# Altium project ESP_Grow_Main_V2.PrjPCB (part 1 of 2)
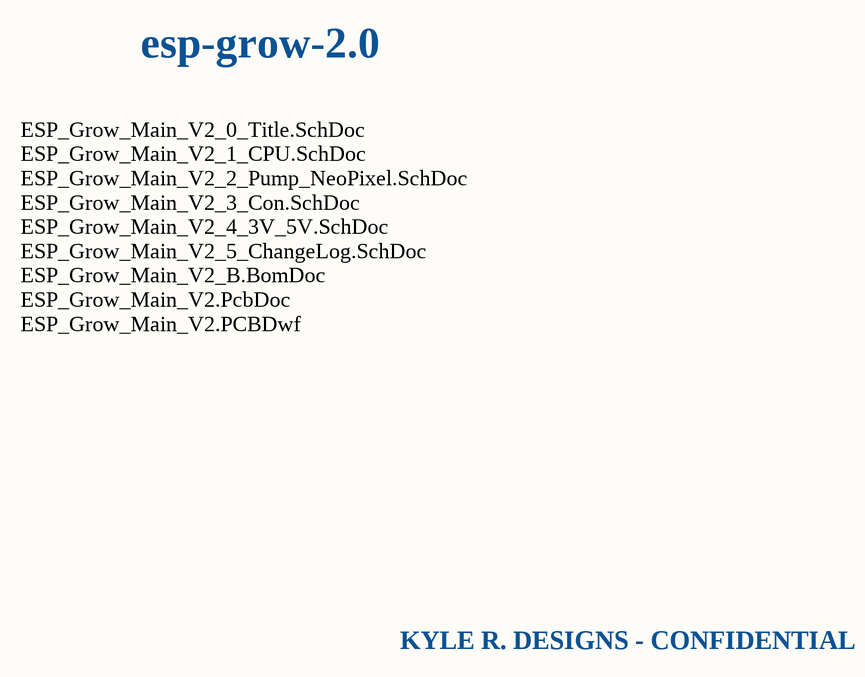
[diagram p0: ESP_Grow_Main_V2_0_Title.SchDoc]
5 sheets, 127 parts. Net scope: global (net labels, ports and power ports of the same name join across sheets).
Board file: ESP_Grow_Main_V2.PcbDoc
Sheets:
  ESP_Grow_Main_V2_0_Title.SchDoc
  ESP_Grow_Main_V2_1_CPU.SchDoc
  ESP_Grow_Main_V2_2_Pump_NeoPixel.SchDoc
  ESP_Grow_Main_V2_3_Con.SchDoc
  ESP_Grow_Main_V2_4_3V_5V.SchDoc

## Sheet ESP_Grow_Main_V2_0_Title.SchDoc: Title Page
size A; Author: Kyle R; DocumentNumber: 3282021; Revision: A; SheetNumber: 0; SheetTotal: 5

### Notes on the sheet
- esp-grow-2.0
- ESP_Grow_Main_V2_0_Title.SchDoc
  ESP_Grow_Main_V2_1_CPU.SchDoc
  ESP_Grow_Main_V2_2_Pump_NeoPixel.SchDoc
  ESP_Grow_Main_V2_3_Con.SchDoc
  ESP_Grow_Main_V2_4_3V_5V.SchDoc
  ESP_Grow_Main_V2_5_ChangeLog.SchDoc
  ESP_Grow_Main_V2_B.BomDoc
  ESP_Grow_Main_V2.PcbDoc
  ESP_Grow_Main_V2.PCBDwf
- KYLE R. DESIGNS - CONFIDENTIAL

## Sheet ESP_Grow_Main_V2_1_CPU.SchDoc: CPU
size A; DocumentNumber: 3/7/2021; Revision: A; SheetNumber: 5; SheetTotal: 1
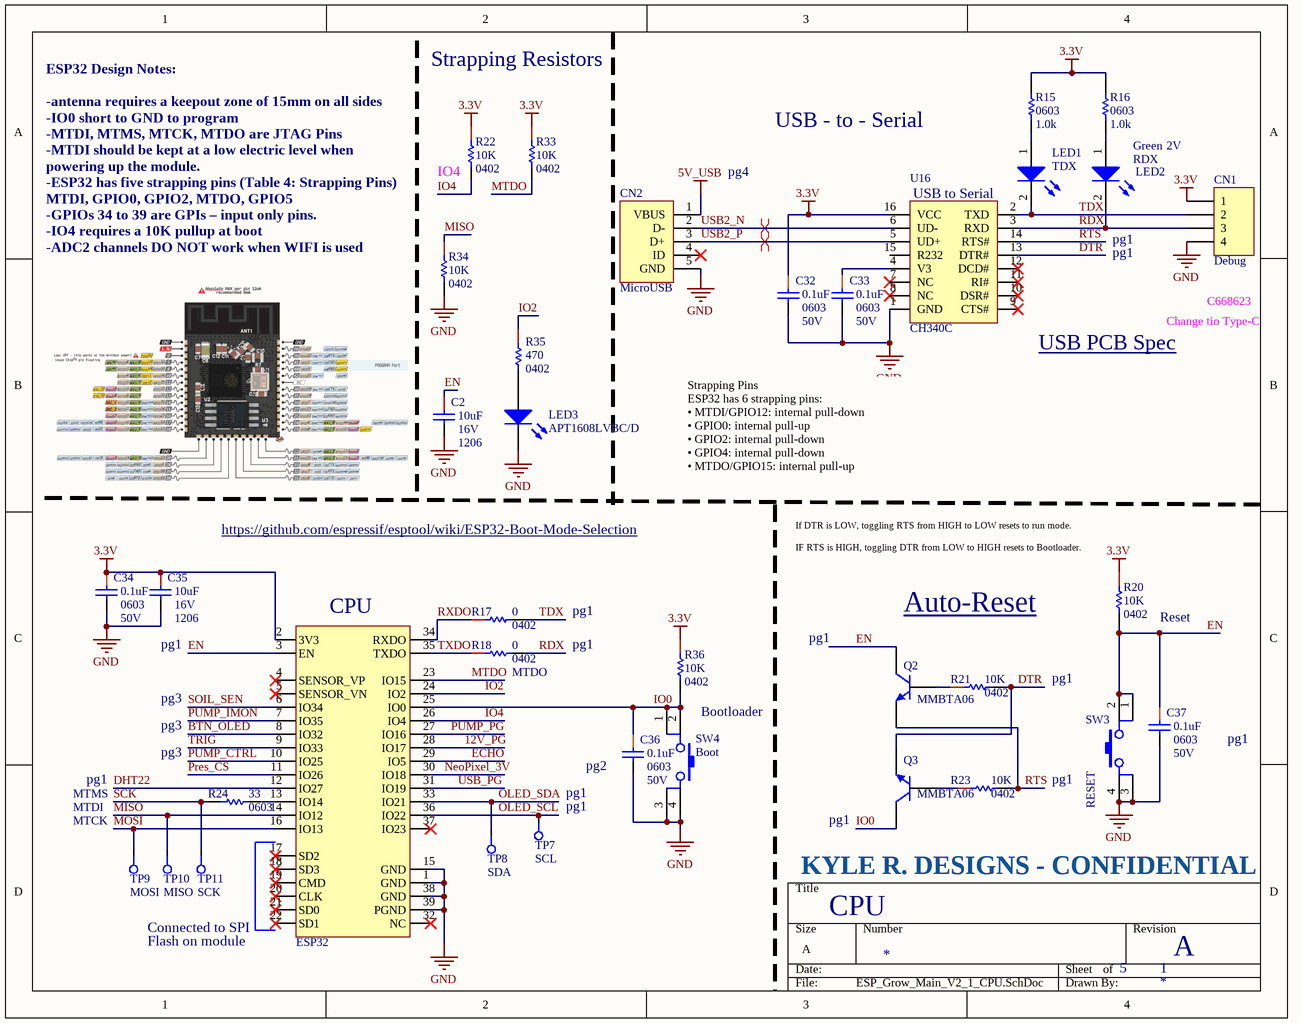
[diagram p1: ESP_Grow_Main_V2_1_CPU.SchDoc]

### Parts
C2  10uF  Voltage - Rated: 16V  Package: 1206  [CAPC1206(3216)_M]
C32  Package / Case: 0603  Voltage - Rated: 50V  [CAPC0603(1608)_L]  (hidden comment: 0.1uF)
C33  Package / Case: 0603  Voltage - Rated: 50V  [CAPC0603(1608)_L]  (hidden comment: 0.1uF)
C34  Package / Case: 0603  Voltage - Rated: 50V  [CAPC0603(1608)_L]  (hidden comment: 0.1uF)
C35  10uF  Voltage - Rated: 16V  Package: 1206  [CAPC1206(3216)_M]
C36  Package / Case: 0603  Voltage - Rated: 50V  [CAPC0603(1608)_L]  (hidden comment: 0.1uF)
C37  Package / Case: 0603  Voltage - Rated: 50V  [CAPC0603(1608)_L]  (hidden comment: 0.1uF)
CN1  Debug  [HDR1X4]
CN2  MicroUSB  [10118194-0001LF]
LED1  TDX  [SM-LED-0603]
LED2  RDX  Color: Green  Voltage - Forward (Vf) (Typ): 2V  [SM-LED-0603]
LED3  APT1608LVBC/D  [SM-LED-0603]
Q2  MMBTA06  [SOT23]
Q3  MMBTA06  [SOT23]
R15  Package / Case: 0603  [RESC0603(1608)_N]  (hidden comment: 1.0K)
R16  Package / Case: 0603  [RESC0603(1608)_N]  (hidden comment: 1.0K)
R17  Package (Imperial): 0402  Resistance: 0  [RESC0402(1005)_M]  (hidden comment: 0.0)
R18  Package (Imperial): 0402  Resistance: 0  [RESC0402(1005)_M]  (hidden comment: 0.0)
R20  Resistance: 10K  Package: 0402  [RESC0402(1005)_N]  (hidden comment: 0402WGF1002TCE)
R21  Resistance: 10K  Package: 0402  [RESC0402(1005)_N]  (hidden comment: 0402WGF1002TCE)
R22  Resistance: 10K  Package: 0402  [RESC0402(1005)_N]  (hidden comment: 0402WGF1002TCE)
R23  Resistance: 10K  Package: 0402  [RESC0402(1005)_N]  (hidden comment: 0402WGF1002TCE)
R24  Package / Case: 0603  [RESC0603(1608)_L]  (hidden comment: 33)
R33  Resistance: 10K  Package: 0402  [RESC0402(1005)_N]  (hidden comment: 0402WGF1002TCE)
R34  Resistance: 10K  Package: 0402  [RESC0402(1005)_N]  (hidden comment: 0402WGF1002TCE)
R35  Package (Imperial): 0402  [RESC0402(1005)_M]  (hidden comment: 470)
R36  Resistance: 10K  Package: 0402  [RESC0402(1005)_N]  (hidden comment: 0402WGF1002TCE)
SW3  RESET  [SW TACT Red 6mm x 6mm]
SW4  Boot  [SW TACT Red 6mm x 6mm]
TP7  SCL  [Pogo-Testpoint]  (no BOM)
TP8  SDA  [Pogo-Testpoint]  (no BOM)
TP9  MOSI  [Pogo-Testpoint]  (no BOM)
TP10  MISO  [Pogo-Testpoint]  (no BOM)
TP11  SCK  [Pogo-Testpoint]  (no BOM)
U16  CH340C  [SOP-16]
U17  ESP32  [ESP32]

### Nets
3.3V: C32.1 C34.1 C35.1 CN1.1 R15.2 R16.2 R20.1 R22.1 R33.1 R36.1 U16.16(VCC) U17.2(3V3)
5V_USB: CN2.1(VBUS)
GND: C2.2 C32.2 C33.2 C34.2 C35.2 C36.2 C37.2 CN1.4 CN2.5(GND) LED3.2(Cathode) R34.2 SW3.3 SW3.4 SW4.3 SW4.4 U16.1(GND) U17.1(GND) U17.15(GND) U17.38(GND) U17.39(PGND)
12V_PG: U17.28(IO17)
BTN_OLED: U17.8(IO32)
DHT22: U17.12(IO27)
DTR: Q3.2(E) R21.2 U16.13(DTR#)
ECHO: U17.29(IO5)
EN: C2.1 C37.1 Q2.3(C) R20.2 SW3.1 SW3.2 U17.3(EN)
IO0: C36.1 Q3.3(C) R36.2 SW4.1 SW4.2 U17.25(IO0)
IO2: R35.1 U17.24(IO2)
IO4: R22.2 U17.26(IO4)
MISO: R34.1 TP10.1 U17.14(IO12)
MOSI: TP9.1 U17.16(IO13)
MTDO: R33.2 U17.23(IO15)
NeoPixel_3V: U17.30(IO18)
OLED_SCL: TP7.1 U17.36(IO22)
OLED_SDA: TP8.1 U17.33(IO21)
Pres_CS: U17.11(IO26)
PUMP_CTRL: U17.10(IO25)
PUMP_IMON: U17.7(IO35)
PUMP_PG: U17.27(IO16)
RDX: CN1.3 LED2.2(K) R18.2 U16.3(RXD)
RTS: Q2.2(E) R23.2 U16.14(RTS#)
RXDO: R17.1 U17.34(RXDO)
SCK: R24.2 TP11.1
SOIL_SEN: U17.6(IO34)
TDX: CN1.2 LED1.2(K) R17.2 U16.2(TXD)
TRIG: U17.9(IO33)
TXDO: R18.1 U17.35(TXDO)
USB2_N: CN2.2(D-) U16.6(UD-)
USB2_P: CN2.3(D+) U16.5(UD+)
USB_PG: U17.31(IO19)
NetC33_1: C33.1 U16.4(V3)
NetLED1_1: LED1.1(A) R15.1
NetLED2_1: LED2.1(A) R16.1
NetLED3_1: LED3.1(Anode) R35.2
NetQ2_1: Q2.1(B) R21.1
NetQ3_1: Q3.1(B) R23.1
NetR24_1: R24.1 U17.13(IO14)

Not connected (* = marked no-connect by the designer): CN2 4(ID)*; U16 7(NC)* 8(NC)* 9(CTS#)* 10(DSR#)* 11(RI#)* 12(DCD#)* 15(R232); U17 4(SENSOR_VP)* 5(SENSOR_VN)* 17(SD2)* 18(SD3)* 19(CMD)* 20(CLK)* 21(SD0)* 22(SD1)* 32(NC)* 37(IO23)*

### Layout directives
differential pair: USB2_N, USB2_P

### Notes on the sheet
- Strapping Resistors
- USB - to - Serial
- (near R22) IO4
- pg4
- pg1
- (near U16) USB PCB Spec <https://www.ftdichip.com/Support/Documents/AppNotes/AN_146_USB_Hardware_Design_Guidelines_for_FTDI_ICs.pdf>
- Change tio Type-C
- C668623
- ESP32 Design Notes:
  -antenna requires a keepout zone of 15mm on all sides
  -IO0 short to GND to program
  -MTDI, MTMS, MTCK, MTDO are JTAG Pins
  -MTDI should be kept at a low electric level when powering up the module.
  -ESP32 has five strapping pins (Table 4: Strapping Pins) MTDI, GPIO0, GPIO2, MTDO, GPIO5
  -GPIOs 34 to 39 are GPIs – input only pins.
  -IO4 requires a 10K pullup at boot
  -ADC2 channels DO NOT work when WIFI is used
- Strapping Pins
  ESP32 has 6 strapping pins:
  • MTDI/GPIO12: internal pull-down
  • GPIO0: internal pull-up
  • GPIO2: internal pull-down
  • GPIO4: internal pull-down
  • MTDO/GPIO15: internal pull-up
  • GPIO5: internal pull-up
- https://github.com/espressif/esptool/wiki/ESP32-Boot-Mode-Selection
- (near R20) If DTR is LOW, toggling RTS from HIGH to LOW resets to run mode.
  IF RTS is HIGH, toggling DTR from LOW to HIGH resets to Bootloader.
- (near U17) CPU
- Auto-Reset <https://cdn.sparkfun.com/assets/learn_tutorials/5/0/7/esp32-thing-schematic.pdf>
- (near R20) Reset
- (near C35) pg1
- pg3
- (near R18) MTDO
- (near C36) pg2
- Bootloader
- MTMS
- MTDI
- (near TP9) MTCK
- (near TP7) pg1
- (near Q3) pg1
- KYLE R. DESIGNS - CONFIDENTIAL
- (near U17) Flash on module
- (near U17) Connected to SPI
- (in symbol CH340C) USB to Serial

### Library data of the parts
C2 C35 = CAP CER 10UF 16V 1206: Temperature Coefficient: X7R; LCSC: C126600; Capacitance: 10uF; Supplier 1: Digi-Key; Supplier Part Number 1: 490-4793-1-ND
C32-C34 C36 C37 = 0.1uF_0603: 100NF 50V 0603; Manufacturer: YAGEO; Manufacturer Part Number: CC0603KRX7R9BB104; Tolerance: ±10%; Temperature Coefficient: X7R; Supplier 1: Digi-Key; RoHS: RoHS Compliant; Category: Capacitors; Stock 1: 2360000; Pricing 1: 4000=0.00414, 8000=0.00378, 12000=0.0036, 28000=0.00342, 100000=0.00248 (USD); Packaging: Tape & Reel (TR); Mounting Type: Surface Mount, MLCC; Operating Temperature: -55°C ~ 125°C; Applications: General Purpose; Ratings: -; Size / Dimension: 0.063" L x 0.031" W (1.60mm x 0.80mm); Height - Seated (Max): -; Thickness (Max): 0.034" (0.87mm); Lead Spacing: -; Features: -; Lead Style: -; ComponentLink1URL: http://www.kemet.com/datasheets&C0603C104K4RACTU; ComponentLink1Description: http://www.kemet.com/datasheets&C0603C104K4RACTU; Supplier Part Number 1: 399-1096-2-ND; ComponentLink2Description: New link; ComponentLink2URL: *; LCSC Part #: C14663; Capacitance: 0.1uF
CN1 = Header 4: Header, 4-Pin; Manufacturer: Sullins Connector Solutions; Manufacturer Part Number: PRPC004SAAN-RC; Connector Type: Header, Unshrouded, Breakaway; Number of Positions: 4; Number of Positions Loaded: All; Pitch: 0.100" (2.54mm); Supplier 1: Digi-Key; RoHS: RoHS Compliant; Category: Connectors, Interconnects; Stock 1: 0; Pricing 1: 1=0.2, 10=0.175, 100=0.1443, 500=0.1141, 1000=0.09794, 5000=0.08935, 10000=0.08591 (USD); Packaging: Bulk; Contact Type: Male Pin; Number of Rows: 1; Row Spacing: -; Contact Mating Length: 0.230" (5.84mm); Mounting Type: Through Hole; Termination: Solder; Fastening Type: -; Features: -; Contact Finish: Gold; Contact Finish Thickness: Flash; Color: Black; ComponentLink1URL: http://media.digikey.com/PDF/Data%20Sheets/Sullins%20PDFs/xRxCzzzSxxN-RC_ST_11635-B.pdf; ComponentLink1Description: http://media.digikey.com/PDF/Data%20Sheets/Sullins%20PDFs/xRxCzzzSxxN-RC_ST_11635-B.pdf; Supplier Part Number 1: S1011EC-04-ND
CN2 = 10118194-0001LF: Amphenol FCI CONN USB MICRO B RECPT SMT R/A; Connector Type: USB - micro B; Number of Contacts: 5; Gender: Receptacle; Specifications: USB 2.0; Number of Ports: 1; Current Rating: 1.8A per Contact; Voltage - Rated: 100VAC; Mating Cycles: 10000; Shielding: Shielded; Material Flammability Rating: UL94 V-0; ClassName: *; Supplier 1: Digi-Key; Manufacturer: Amphenol FCI; Manufacturer Part Number: 10118194-0001LF; RoHS: RoHS Compliant; Category: Connectors, Interconnects; Stock 1: 220681; Pricing 1: 1=0.46, 10=0.437, 25=0.3744, 50=0.318, 100=0.3056, 250=0.27444, 500=0.26196 (USD); Packaging: Cut Tape (CT); Part Status: Active; Mounting Type: Surface Mount, Right Angle; Through Hole; Mounting Feature: Horizontal; Termination: Solder; Features: Solder Retention; Ingress Protection: -; Operating Temperature: -30°C ~ 80°C; Contact Finish: Gold; Shell/Shielding Material: Steel, Stainless; Insulation Color: Black; ComponentLink1URL: http://portal.fciconnect.com/Comergent//fci/drawing/10118194.pdf; ComponentLink1Description: http://portal.fciconnect.com/Comergent//fci/drawing/10118194.pdf; Supplier Part Number 1: 609-4618-1-ND
LED1 = CMP-001-0086-06: LED GREEN CLEAR THIN 0603 SMD; Manufacturer Part Number: LTST-C191KGKT; Manufacturer: Lite-On Inc; Millicandela Rating: 35mcd; Wavelength - Peak: 574nm; Current - Test: 20mA; Wavelength - Dominant: 571nm; Viewing Angle: 130°; Lens Style/Size: Rectangle with Flat Top, 1.1mm x 0.8mm; Voltage - Forward (Vf) (Typ): 2V; Color: Green; Size / Dimension: 1.60mm L x 0.80mm W; Mounting Type: Surface Mount; Designator: LTST-C191KGKT; Height: 0.55mm; RoHS: RoHS Compliant; Package / Case: 0603 (1608 Metric); Packaging: Cut Tape (CT); Lens Type: Clear; Pin Count: 2; Stock 1: 84829; Pricing 1: 1=0.3, 10=0.238, 100=0.1296, 250=0.0864, 500=0.07344, 1000=0.05616, 2500=0.05076 (USD); ClassName: *
LED2 = CMP-001-0086-06: LED GREEN CLEAR THIN 0603 SMD; Manufacturer Part Number: LTST-C191KGKT; Manufacturer: Lite-On Inc; Millicandela Rating: 35mcd; Wavelength - Peak: 574nm; Current - Test: 20mA; Wavelength - Dominant: 571nm; Viewing Angle: 130°; Lens Style/Size: Rectangle with Flat Top, 1.1mm x 0.8mm; Size / Dimension: 1.60mm L x 0.80mm W; Mounting Type: Surface Mount; Designator: LTST-C191KGKT; Height: 0.55mm; RoHS: RoHS Compliant; Package / Case: 0603 (1608 Metric); Packaging: Cut Tape (CT); Lens Type: Clear; Pin Count: 2; Stock 1: 84829; Pricing 1: 1=0.3, 10=0.238, 100=0.1296, 250=0.0864, 500=0.07344, 1000=0.05616, 2500=0.05076 (USD); ClassName: *
LED3 = CMP-001-0901-02: LED BLUE CLEAR 2SMD 2.65V; Luminous Intensity: 24mcd; Test Current: 2mA; Dominant Wavelength: 470nm; Viewing Angle: 120°; Lens Color: Colorless; Case Code (Metric): 1608; Length: 1.6mm; Forward Voltage: 2.65V; Width: 0.8mm; Height: 0.75mm; Packaging: Tape and Reel; Case/Package: 0603; Mount: Surface Mount; Color: Blue; Lens Transparency: Clear; Case Code (Imperial): 0603
Q2 Q3 = MMBTA06: TRANS NPN 80V 0.5A SOT-23; Manufacturer: ON Semiconductor; Manufacturer Part Number: MMBTA06LT3G; Vce Saturation (Max) @ Ib, Ic: 250mV @ 10mA, 100mA; Current - Collector Cutoff (Max): 100nA; DC Current Gain (hFE) (Min) @ Ic, Vce: 100 @ 100mA, 1V; Frequency - Transition: 100MHz; Supplier 1: Digi-Key; RoHS: RoHS Compliant; Category: Discrete Semiconductor Products; Stock 1: 16604; Pricing 1: 1=0.21, 10=0.196, 100=0.1067, 500=0.06566, 1000=0.04476 (USD); Packaging: Cut Tape (CT); Part Status: Active; Transistor Type: NPN; Operating Temperature: -55°C ~ 150°C (TJ); Mounting Type: Surface Mount; Package / Case: TO-236-3, SC-59, SOT-23-3; Supplier Device Package: SOT-23-3 (TO-236); Base Part Number: MMBTA06; ComponentLink1URL: http://www.onsemi.com/pub/Collateral/MMBTA05LT1-D.PDF; ComponentLink1Description: http://www.onsemi.com/pub/Collateral/MMBTA05LT1-D.PDF; Supplier Part Number 1: MMBTA06LT3GOSCT-ND
R15 R16 = RES 1K OHM 1% 1/10W 0603: 1.0K 0603; Manufacturer: Stackpole Electronics Inc.; Manufacturer Part Number: RMCF0603FT1K00; Tolerance: ±1%; Power (Watts): 0.1W, 1/10W; Temperature Coefficient: ±100ppm/°C; Supplier 1: Digi-Key; RoHS: RoHS Compliant; Category: Resistors; Stock 1: 411308; Pricing 1: 1=0.1, 10=0.02, 100=0.0081, 1000=0.00364, 2500=0.00316 (USD); Packaging: Cut Tape (CT); Part Status: Active; Composition: Thick Film; Features: Automotive AEC-Q200; Operating Temperature: -55°C ~ 155°C; Size / Dimension: 0.061" L x 0.031" W (1.55mm x 0.80mm); Height - Seated (Max): 0.022" (0.55mm); Failure Rate: -; ComponentLink1URL: https://www.seielect.com/Catalog/SEI-RMCF_RMCP.pdf; ComponentLink1Description: https://www.seielect.com/Catalog/SEI-RMCF_RMCP.pdf; Supplier Part Number 1: RMCF0603FT1K00CT-ND; Supplier Device Package: 0603; Resistance (Ohms): 1.0k
R17 R18 = CMP-007-0303-14: RES 0.0 OHM JUMPER 1/10W 0402; Power: 63mW; Package (Metric): 1005; Tolerance: 0%; Operating Temperature: -55°C ~ 155°C; Length: 1mm; Temperature Coefficient: -; Height: 400µm; Termination: SMD/SMT
R20-R23 R33 R34 R36 = 10k_0402: 10KOHMS ±1% 1/10W 0402; Supplier Part Number 1: C25744; Manufacturer Part Number 1: 0402WGF1002TCE; Supplier 1: LCSC
R24 = RES 33 OHM 1/10W 5% 0603 SMD: 33 0603; Manufacturer: Panasonic Electronic Components; Manufacturer Part Number: ERJ-3GEYJ330V; Tolerance: ±5%; Power (Watts): 0.1W, 1/10W; Temperature Coefficient: ±200ppm/°C; Supplier 1: Digi-Key; RoHS: RoHS Compliant; Category: Resistors; Stock 1: 499360; Pricing 1: 1=0.1, 50=0.0126, 100=0.0096, 250=0.00716, 500=0.00528, 1000=0.00352, 2500=0.00297 (USD); Packaging: Cut Tape (CT); Resistance (Ohms): 33; Composition: Thick Film; Features: -; Supplier Device Package: 0603; Size / Dimension: 0.063" L x 0.031" W (1.60mm x 0.80mm); Height: 0.022" (0.55mm); Number of Terminations: 2; ComponentLink1URL: http://industrial.panasonic.com/www-cgi/jvcr13pz.cgi?E+PZ+3+AOA0001+ERJ3GEYJ330V+7+WW; ComponentLink1Description: http://industrial.panasonic.com/www-cgi/jvcr13pz.cgi?E+PZ+3+AOA0001+ERJ3GEYJ330V+7+WW; Supplier Part Number 1: P33GCT-ND
R35 = CMP-007-0512-12: RES 470 OHM 1% 1/10W 0402; Temperature Coefficient: ±100ppm/°C; Power: 63mW; Package (Metric): 1005; Operating Temperature: -55°C ~ 155°C; Height: 400µm; Length: 1mm; Termination: SMD/SMT; Tolerance: 1%; Resistance: 470
SW3 SW4 = PTS645SM43SMTR92 LFS: SWITCH TACTILE SPST-NO 0.05A 12V; Manufacturer: C&K; Switch Function: Off-Mom; Contact Rating @ Voltage: 0.05A @ 12VDC; Actuator Type: Standard; Actuator Height off PCB, Vertical: 4.30mm; Actuator Orientation: Top Actuated; Outline: 6.00mm x 6.00mm; Illumination: Non-Illuminated; Operating Force: 160gf; Actuator Material: Polyamide (PA66), Nylon 6/6; Mechanical Life: 100,000 Cycles; ClassName: *; Supplier 1: Digi-Key; Manufacturer Part Number: PTS645SM43SMTR92 LFS; RoHS: RoHS Compliant; Category: Switches; Stock 1: 234699; Pricing 1: 1=0.15, 10=0.147, 25=0.1416, 50=0.1366, 100=0.129, 250=0.12144, 500=0.11638 (USD); Packaging: Cut Tape (CT); Part Status: Active; Circuit: SPST-NO; Mounting Type: Surface Mount; Actuator Length, Right Angle: -; Termination Style: Gull Wing; Illumination Type, Color: -; Illumination Voltage (Nominal): -; Ingress Protection: -; Features: Blue Actuator; Switch Travel: -; Operating Temperature: -20°C ~ 60°C; ComponentLink1URL: http://www.ckswitches.com/media/1471/pts645.pdf; ComponentLink1Description: http://www.ckswitches.com/media/1471/pts645.pdf; Supplier Part Number 1: CKN9112CT-ND
TP7-TP11 = CMP-001-0557-03: Test Point- Current one; Pin Count: 1; Component Name: TestPoint; Designator: TestPoint
U16 = CH340C: USB to Serial UART; ComponentLink2URL: https://lcsc.com/product-detail/USB_CH340C_C84681.html; ComponentLink1URL: https://www.sparkfun.com/products/15096; ComponentLink2Description: LCSC Part Link; ComponentLink1Description: Sparkfun Demo Board
U17 = U/ESP32-WROOM-32D: ESP32 module

## Sheet ESP_Grow_Main_V2_2_Pump_NeoPixel.SchDoc: Pump_Neopixel
size A; Date: 06/02/2019; Author: Kyle R.; Revision: A; SheetNumber: 2; SheetTotal: 5
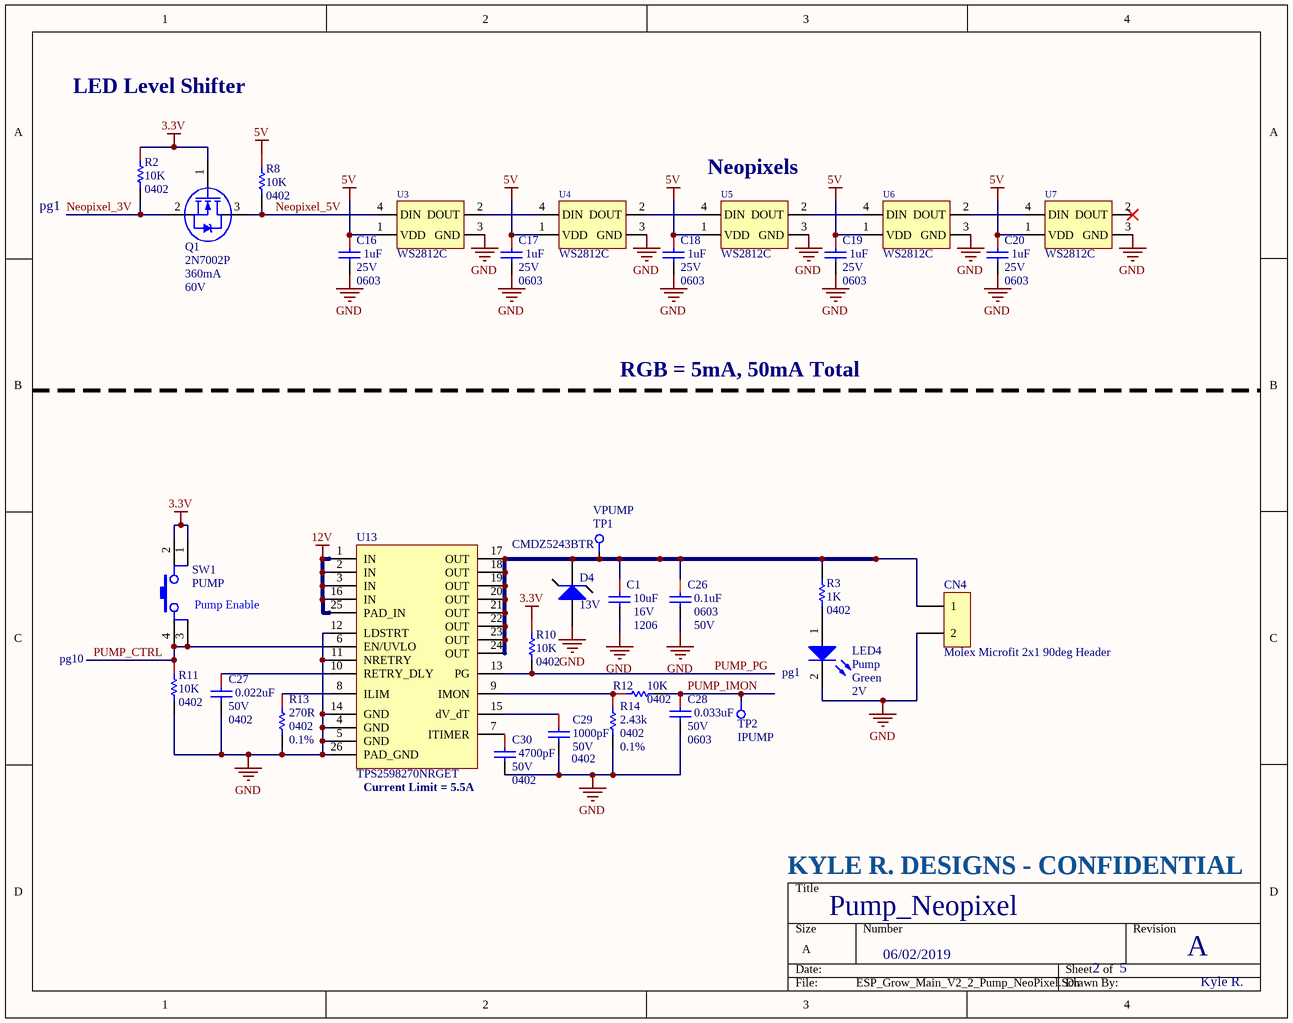
[diagram p2: ESP_Grow_Main_V2_2_Pump_NeoPixel.SchDoc]

### Parts
C1  10uF  Voltage - Rated: 16V  Package: 1206  [CAPC1206(3216)_M]
C16  1uF  Voltage - Rated: 25V  Package / Case: 0603  [CAPC0603(1608)_N]
C17  1uF  Voltage - Rated: 25V  Package / Case: 0603  [CAPC0603(1608)_N]
C18  1uF  Voltage - Rated: 25V  Package / Case: 0603  [CAPC0603(1608)_N]
C19  1uF  Voltage - Rated: 25V  Package / Case: 0603  [CAPC0603(1608)_N]
C20  1uF  Voltage - Rated: 25V  Package / Case: 0603  [CAPC0603(1608)_N]
C26  Package / Case: 0603  Voltage - Rated: 50V  [CAPC0603(1608)_L]  (hidden comment: 0.1uF)
C27  0.022uF  Voltage (Rated): 50V  Package (Imperial): 0402  [CAPC0402(1005)_N]
C28  0.033uF  Voltage (Rated): 50V  Package (Imperial): 0603  [CAPC0603(1608)_L]
C29  Voltage - Rated: 50V  Package / Case: 0402  [CAPC0402(1005)_N]  (hidden comment: 1000pF)
C30  4700pF  Voltage (Rated): 50V  Package (Imperial): 0402  [CAPC0402(1005)_L]
CN4  Molex Microfit 2x1 90deg Header  [Molex 2x1 Microfit 90deg]
D4  CMDZ5243BTR  Zener Voltage: 13V  [SOD-323]
LED4  Pump  Color: Green  Voltage - Forward (Vf) (Typ): 2V  [SM-LED-0603]
Q1  2N7002P  Continuous Drain Current (ID): 360mA  Drain to Source Voltage (Vdss): 60V  [SOT23]
R2  Resistance: 10K  Package: 0402  [RESC0402(1005)_N]  (hidden comment: 0402WGF1002TCE)
R3  Package / Case: 0402  [RESC0402(1005)_L]  (hidden comment: 1K)
R8  Resistance: 10K  Package: 0402  [RESC0402(1005)_N]  (hidden comment: 0402WGF1002TCE)
R10  Resistance: 10K  Package: 0402  [RESC0402(1005)_N]  (hidden comment: 0402WGF1002TCE)
R11  Resistance: 10K  Package: 0402  [RESC0402(1005)_N]  (hidden comment: 0402WGF1002TCE)
R12  Resistance: 10K  Package: 0402  [RESC0402(1005)_N]  (hidden comment: 0402WGF1002TCE)
R13  Tolerance: 0.1%  Resistance: 270R  Case Code (Imperial): 0402  [RESC0402(1005)_N]  (hidden comment: 270)
R14  Tolerance: 0.1%  Case/Package: 0402  Resistance: 2.43k  [RESC0402(1005)_L]  (hidden comment: 2.34k)
SW1  PUMP  [SW TACT Red 6mm x 6mm]
TP1  VPUMP  [Pogo-Testpoint]  (no BOM)
TP2  IPUMP  [Pogo-Testpoint]  (no BOM)
U3  WS2812C  [WS2812C]
U4  WS2812C  [WS2812C]
U5  WS2812C  [WS2812C]
U6  WS2812C  [WS2812C]
U7  WS2812C  [WS2812C]
U13  TPS2598270NRGET  [VQFN_24]

### Nets
3.3V: Q1.1(G) R2.1 R10.1 SW1.1 SW1.2
5V: C16.1 C17.1 C18.1 C19.1 C20.1 R8.1 U3.1(VDD) U4.1(VDD) U5.1(VDD) U6.1(VDD) U7.1(VDD)
12V: U13.1(IN) U13.2(IN) U13.3(IN) U13.16(IN) U13.25(PAD_IN)
GND: C1.2 C16.2 C17.2 C18.2 C19.2 C20.2 C26.2 C27.2 C28.2 C29.2 C30.2 CN4.2 D4.2(A) LED4.2(K) R11.2 R13.2 R14.2 U3.3(GND) U4.3(GND) U5.3(GND) U6.3(GND) U7.3(GND) U13.4(GND) U13.5(GND) U13.11(NRETRY) U13.12(LDSTRT) U13.14(GND) U13.26(PAD_GND)
NeoPixel_3V: Q1.2(S) R2.2
Neopixel_5V: Q1.3(D) R8.2 U3.4(DIN)
PUMP_CTRL: R11.1 SW1.3 SW1.4 U13.6(EN/UVLO)
PUMP_IMON: C28.1 R12.2 TP2.1
PUMP_PG: R10.2 U13.13(PG)
NetC1_1: C1.1 C26.1 CN4.1 D4.1(K) R3.2 TP1.1 U13.17(OUT) U13.18(OUT) U13.19(OUT) U13.20(OUT) U13.21(OUT) U13.22(OUT) U13.23(OUT) U13.24(OUT)
NetC27_1: C27.1 U13.10(RETRY_DLY)
NetC29_1: C29.1 U13.15(dV_dT)
NetC30_1: C30.1 U13.7(ITIMER)
NetLED4_1: LED4.1(A) R3.1
NetR12_1: R12.1 R14.1 U13.9(IMON)
NetR13_1: R13.1 U13.8(ILIM)
NetU3_2: U3.2(DOUT) U4.4(DIN)
NetU4_2: U4.2(DOUT) U5.4(DIN)
NetU5_2: U5.2(DOUT) U6.4(DIN)
NetU6_2: U6.2(DOUT) U7.4(DIN)

Not connected (* = marked no-connect by the designer): U7 2(DOUT)*

### Notes on the sheet
- LED Level Shifter
- pg1
- (near U5) Neopixels
- RGB = 5mA, 50mA Total
- (near SW1) Pump Enable
- pg10
- (near LED4) pg1
- Current Limit = 5.5A
- KYLE R. DESIGNS - CONFIDENTIAL

### Library data of the parts
C1 = CAP CER 10UF 16V 1206: Temperature Coefficient: X7R; LCSC: C126600; Capacitance: 10uF; Supplier 1: Digi-Key; Supplier Part Number 1: 490-4793-1-ND
C16-C20 = CAP CER 1UF 25V 10% X7R 0603: 1uF 0603 25V; Manufacturer: TDK Corporation; Manufacturer Part Number: CGA3E1X7R1E105K080AC; Tolerance: ±10%; Temperature Coefficient: X7R; Supplier 1: Digi-Key; RoHS: RoHS Compliant; Category: Capacitors; Stock 1: 360610; Pricing 1: 1=0.2, 10=0.135, 100=0.0686, 500=0.04696, 1000=0.04154 (USD); Packaging: Cut Tape (CT); Part Status: Active; Operating Temperature: -55°C ~ 125°C; Features: -; Ratings: AEC-Q200; Applications: Automotive; Failure Rate: -; Mounting Type: Surface Mount, MLCC; Size / Dimension: 0.063" L x 0.032" W (1.60mm x 0.80mm); Height - Seated (Max): -; Thickness (Max): 0.035" (0.90mm); Lead Spacing: -; Lead Style: -; ComponentLink1URL: https://product.tdk.com/info/en/catalog/datasheets/mlcc_automotive_general_en.pdf; ComponentLink1Description: https://product.tdk.com/info/en/catalog/datasheets/mlcc_automotive_general_en.pdf; Supplier Part Number 1: 445-6931-1-ND
C26 = 0.1uF_0603: as C32 on sheet ESP_Grow_Main_V2_1_CPU; Supplier 1: Digi-Key; RoHS: RoHS Compliant; Category: Capacitors; Stock 1: 2360000; Pricing 1: 4000=0.00414, 8000=0.00378, 12000=0.0036, 28000=0.00342, 100000=0.00248 (USD); Packaging: Tape & Reel (TR); Mounting Type: Surface Mount, MLCC; Operating Temperature: -55°C ~ 125°C; Applications: General Purpose; Ratings: -; Size / Dimension: 0.063" L x 0.031" W (1.60mm x 0.80mm); Height - Seated (Max): -; Thickness (Max): 0.034" (0.87mm); Lead Spacing: -; Features: -; Lead Style: -; ComponentLink1URL: http://www.kemet.com/datasheets&C0603C104K4RACTU; ComponentLink1Description: http://www.kemet.com/datasheets&C0603C104K4RACTU; Supplier Part Number 1: 399-1096-2-ND; ComponentLink2Description: New link; ComponentLink2URL: *; LCSC Part #: C14663; Capacitance: 0.1uF
C27 = CMP-007-0030-08: CAP CER 0.022UF 50V X7R 0402; Tolerance: 10%; Package (Metric): 1005; Capacitance: 22nF; Dielectric Material: Ceramic; Temperature Coefficient: X7R; Mounting Type: SMD
C28 = CMP-007-0033-08: CAP CER 0.033UF 50V X7R 0603; Tolerance: 5%; Package (Metric): 1608; Dielectric Material: Ceramic; Capacitance: 33nF; Temperature Coefficient: X7R; Mounting Type: SMD
C29 = CAP CER 1000PF 50V C0G/NP0 0402: 1000pF 50V C0G 0402 Kemet 2017; Manufacturer Part Number: C0402C102J5GACTU; Tolerance: ±5%; Temperature Coefficient: C0G, NP0; Supplier 1: Digi-Key; Manufacturer: KEMET; RoHS: RoHS Compliant; Category: Capacitors; Stock 1: 1400284; Pricing 1: 1=0.1, 10=0.07, 100=0.031, 500=0.02214, 1000=0.01739, 2500=0.01581, 5000=0.01455 (USD); Packaging: Cut Tape (CT); Part Status: Active; Operating Temperature: -55°C ~ 125°C; Features: Low ESL; Ratings: -; Applications: General Purpose; Failure Rate: -; Mounting Type: Surface Mount, MLCC; Size / Dimension: 0.039" L x 0.020" W (1.00mm x 0.50mm); Height - Seated (Max): -; Thickness (Max): 0.022" (0.55mm); Lead Spacing: -; Lead Style: -; Supplier Part Number 1: 399-10034-1-ND; Capacitance: 1000pF
C30 = CMP-007-0152-08: CAP CER 4700PF 50V X7R 0402; Dielectric Material: Ceramic; Package (Metric): 1005; Tolerance: 10%; Capacitance: 4.7nF; Mounting Type: SMD; Temperature Coefficient: X7R
CN4 = MICROFIT 3.0 HDR 90deg 2x1CKT: Manufacturer: Molex Inc; Manufacturer Part Number: 0430450200; Connector Type: Header, Shrouded; Number of Positions: 2; Number of Positions Loaded: All; Pitch: 0.118" (3.00mm); ClassName: *; Supplier 1: Digi-Key; RoHS: RoHS Compliant; Category: Connectors, Interconnects; Stock 1: 5243; Pricing 1: 1=0.92, 10=0.809, 50=0.7298, 100=0.6981, 250=0.6346, 500=0.57114, 1000=0.50768, 2500=0.46008, 5000=0.44422 (USD); Packaging: Tray; Contact Type: Male Pin; Number of Rows: 2; Row Spacing: 0.118" (3.00mm); Contact Mating Length: -; Mounting Type: Through Hole, Right Angle; Termination: Solder; Fastening Type: Locking Ramp; Features: Board Lock; Contact Finish: Tin; Contact Finish Thickness: 100µin (2.54µm); Color: Black; ComponentLink1URL: http://www.molex.com/pdm_docs/sd/430450200_sd.pdf; ComponentLink1Description: http://www.molex.com/pdm_docs/sd/430450200_sd.pdf; Supplier Part Number 1: WM1813-ND
D4 = CMP-001-0939-01: DIODE ZENER 13V 250MW SOD323; Tolerance: 5%; Impedance: 13R; Max Operating Temperature: 150°C; Max Power Dissipation: 250mW; Packaging: Tape and Reel; Min Operating Temperature: -65°C; Mount: Surface Mount
LED4 = CMP-001-0086-06: as LED2 on sheet ESP_Grow_Main_V2_1_CPU; Size / Dimension: 1.60mm L x 0.80mm W; Mounting Type: Surface Mount; Designator: LTST-C191KGKT; Height: 0.55mm; RoHS: RoHS Compliant; Package / Case: 0603 (1608 Metric); Packaging: Cut Tape (CT); Lens Type: Clear; Pin Count: 2; Stock 1: 84829; Pricing 1: 1=0.3, 10=0.238, 100=0.1296, 250=0.0864, 500=0.07344, 1000=0.05616, 2500=0.05076 (USD); ClassName: *
Q1 = CMP-012-0002-05: MOSFET N-CH 60V 0.36A SOT-23; Drain to Source Resistance: 1.6R; Gate to Source Voltage (Vgs): 20V; Turn-Off Delay Time: 10ns; Input Capacitance: 50pF; Max Power Dissipation: 350mW; Rise Time: 4ns; Fall Time: 5ns; Number of Elements: 1; Power Dissipation: 420mW; Turn-On Delay Time: 3ns; Contact Plating: Tin; Case/Package: SOT; Number of Pins: 3; Rds On Max: 1.6R; Package Quantity: 10000; Lead Free: Lead Free; Packaging: Tape and Reel; Max Dual Supply Voltage: 60V; Min Operating Temperature: -55°C; Radiation Hardening: No; Drain to Source Breakdown Voltage: 60V; Max Operating Temperature: 150°C
R2 R8 R10-R12 = 10k_0402: 10KOHMS ±1% 1/10W 0402; Supplier Part Number 1: C25744; Manufacturer Part Number 1: 0402WGF1002TCE; Supplier 1: LCSC
R3 = RES 1K OHM 1% 1/16W 0402: 1K 0402; Manufacturer: Yageo; Manufacturer Part Number: RC0402FR-071KL; Tolerance: 1%; Temperature Coefficient: 100ppm/°C; Power Rating: 62.5mW; Voltage Rating: 50V; ComponentLink1URL: https://datasheet.ciiva.com/2453/pyu-r-int-thick-7-2453361.pdf; ComponentLink1Description: https://datasheet.ciiva.com/2453/pyu-r-int-thick-7-2453361.pdf; ComponentLink2URL: https://datasheet.ciiva.com/2453/pyu-r-int-thick-7-2453362.pdf; ComponentLink2Description: https://datasheet.ciiva.com/2453/pyu-r-int-thick-7-2453362.pdf; ComponentLink3URL: https://datasheet.ciiva.com/2453/pyu-r-int-thick-7-2453363.pdf; ComponentLink3Description: https://datasheet.ciiva.com/2453/pyu-r-int-thick-7-2453363.pdf; ComponentLink4URL: https://datasheet.ciiva.com/22747/1018594-22747509.pdf; ComponentLink4Description: https://datasheet.ciiva.com/22747/1018594-22747509.pdf; ComponentLink5URL: https://datasheet.ciiva.com/15189/getdatasheetpartid-323696-15189334.pdf; ComponentLink5Description: https://datasheet.ciiva.com/15189/getdatasheetpartid-323696-15189334.pdf; ComponentLink6URL: https://datasheet.ciiva.com/16740/pyu-rc0402-51-rohs-l-6-r-16740567.pdf; ComponentLink6Description: https://datasheet.ciiva.com/16740/pyu-rc0402-51-rohs-l-6-r-16740567.pdf; ComponentLink7URL: https://datasheet.ciiva.com/12667/pyu-rc0402-51-rohs-l-6-r-12667930.pdf; ComponentLink7Description: https://datasheet.ciiva.com/12667/pyu-rc0402-51-rohs-l-6-r-12667930.pdf; ComponentLink8URL: https://datasheet.ciiva.com/11819/0900766b80c66297-11819452.pdf; ComponentLink8Description: https://datasheet.ciiva.com/11819/0900766b80c66297-11819452.pdf; Supplier 1: Digi-Key; Supplier Part Number 1: 311-1.00KLRCT-ND; Stock 1: 21888659; Pricing 1: 1=0.1, 10=0.014, 100=0.0056, 1000=0.0025, 2500=0.0022, 5000=0.0018 (USD); Case/Package: 0402; Number of Pins: 2; Case Code (Imperial): 0402; Case Code (Metric): 1005; Min Operating Temperature: -55°C; Max Operating Temperature: 155°C; Packaging: Tape and Reel; Composition: Thick Film; Voltage Rating (DC): 50V; Termination: SMD/SMT; Military Standard: Not; Length: 1mm; Height: 0.32mm; Width: 0.5mm; Depth: 0.5mm; REACH SVHC: Unknown; Lead Free: Lead Free; ComponentLink9URL: https://datasheet.ciiva.com/11819/0900766b80c66297-11819477.pdf; ComponentLink9Description: https://datasheet.ciiva.com/11819/0900766b80c66297-11819477.pdf; ComponentLink10URL: https://datasheet.ciiva.com/12666/pyu-rc0402-51-rohs-l-6-r-12666741.pdf; ComponentLink10Description: https://datasheet.ciiva.com/12666/pyu-rc0402-51-rohs-l-6-r-12666741.pdf; ComponentLink11URL: https://datasheet.ciiva.com/17063/pyu-rc0402-51-rohs-l-6-r-17063193.pdf; ComponentLink11Description: https://datasheet.ciiva.com/17063/pyu-rc0402-51-rohs-l-6-r-17063193.pdf; ComponentLink12URL: https://datasheet.ciiva.com/22747/1018594-22747513.pdf; ComponentLink12Description: https://datasheet.ciiva.com/22747/1018594-22747513.pdf; ComponentLink13URL: https://datasheet.ciiva.com/7849/1018594-7849869.pdf; ComponentLink13Description: https://datasheet.ciiva.com/7849/1018594-7849869.pdf; ComponentLink14URL: https://datasheet.ciiva.com/7983/1018594-7983502.pdf; ComponentLink14Description: https://datasheet.ciiva.com/7983/1018594-7983502.pdf; ComponentLink15URL: https://datasheet.ciiva.com/7849/1018594-7849871.pdf; ComponentLink15Description: https://datasheet.ciiva.com/7849/1018594-7849871.pdf; Category: Resistors; Resistance: 1K
R13 = CMP-001-1332-01: RES SMD 270 OHM 0.1% 1/16W 0402; Power Rating: 30mW; Temperature Coefficient: 25ppm/°C; Voltage Rating (DC): 25V; Package Quantity: 5000; Min Operating Temperature: -55°C; Termination: SMD/SMT; Resistor Type: Thin Film; Lead Free: Lead Free; Max Operating Temperature: 155°C; Height: 0.35mm; REACH SVHC: Unknown; Width: 0.5mm; Length: 1mm; Voltage Rating: 25V; Number of Pins: 2; Case/Package: 0402; Packaging: Tape and Reel; Case Code (Metric): 1005
R14 = CMP-001-1331-01: RES SMD 2.43KOHM 0.1% 1/16W 0402; Voltage Rating (DC): 50V; Power Rating: 63mW; Temperature Coefficient: 25ppm/°C; Voltage Rating: 25V; Case Code (Metric): 1005; Max Operating Temperature: 155°C; Number of Terminations: 2; Package Quantity: 1; Length: 0.039inch; Width: 0.02inch; Features: Automotive AEC-Q200; Lead Free: Lead Free; Weight: 2.8E-05oz; Termination: SMD/SMT; Min Operating Temperature: -55°C; Case Code (Imperial): 0402; Max Power Dissipation: 63mW; Resistor Type: Thin Film,Metal Film; Height: 0.016inch; Mount: Surface Mount; REACH SVHC: Unknown; Packaging: Tape and Reel
SW1 = PTS645SM43SMTR92 LFS: as SW3 on sheet ESP_Grow_Main_V2_1_CPU; ClassName: *; Supplier 1: Digi-Key; Manufacturer Part Number: PTS645SM43SMTR92 LFS; RoHS: RoHS Compliant; Category: Switches; Stock 1: 234699; Pricing 1: 1=0.15, 10=0.147, 25=0.1416, 50=0.1366, 100=0.129, 250=0.12144, 500=0.11638 (USD); Packaging: Cut Tape (CT); Part Status: Active; Circuit: SPST-NO; Mounting Type: Surface Mount; Actuator Length, Right Angle: -; Termination Style: Gull Wing; Illumination Type, Color: -; Illumination Voltage (Nominal): -; Ingress Protection: -; Features: Blue Actuator; Switch Travel: -; Operating Temperature: -20°C ~ 60°C; ComponentLink1URL: http://www.ckswitches.com/media/1471/pts645.pdf; ComponentLink1Description: http://www.ckswitches.com/media/1471/pts645.pdf; Supplier Part Number 1: CKN9112CT-ND
TP1 TP2 = CMP-001-0557-03: Test Point- Current one; Pin Count: 1; Component Name: TestPoint; Designator: TestPoint
U3-U7 = WS2812C: Serial RGB LED; RGB Current: 5mA; Voltage: 3.5V ~ 5.3V; RED Brightness: 60mcd; GREEN Brightness: 245mcd; BLUE Brightness: 65 mcd; White Brightness: 365 mcd; LCSC: C114587; Datasheet: https://datasheet.lcsc.com/szlcsc/Worldsemi-WS2812C_C114587.pdfhttps://datasheet.lcsc.com/szlcsc/Worldsemi-WS2812C_C114587.pdf
U13 = CMP-001-0746-09: 15A, 3mohm eFuse with Accurate Current Monitor and Configurable Retry Timers - No UV Lockout; Current Monitor Output: Accuracy: ±1% (Typical, for IOUT> 2 A); Output Slew Rate (dVdt): Adjustable; Fault Response: Auto-Retry; Over Temperature Protection: Yes; Voltage Input: 2.7 V to 24 V; Over Voltage Protection: N/A on this model; Extra Features: Programmable Load Handshake Timer; Current Limit Threshold: 3 A to 15 A; Rds on: 3-mΩ; Type: Circuit Breaker; Datasheet: https://www.ti.com/lit/gpn/TPS25982; Power Good Output: Yes; Supplier Link: https://www.ti.com/store/ti/en/p/product/?p=PTPS259827ONRGET; ComponentLink1Description: New link; ComponentLink1URL: *

## Sheet ESP_Grow_Main_V2_3_Con.SchDoc: Connectors
size A; Revision: A; SheetNumber: 3; SheetTotal: 5
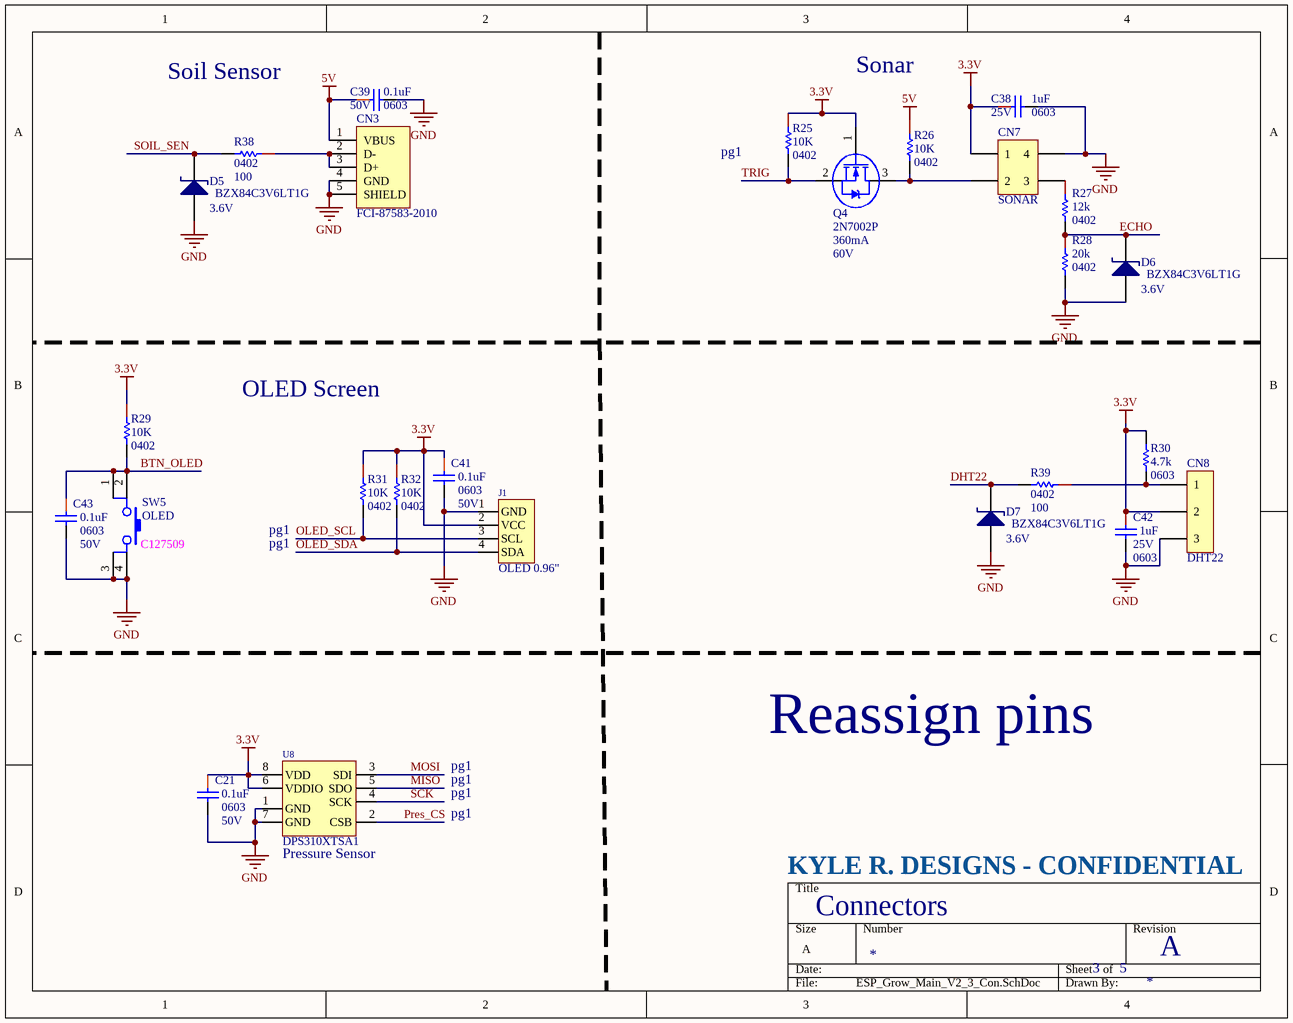
[diagram p3: ESP_Grow_Main_V2_3_Con.SchDoc]

### Parts
C21  Package / Case: 0603  Voltage - Rated: 50V  [CAPC0603(1608)_L]  (hidden comment: 0.1uF)
C38  1uF  Voltage - Rated: 25V  Package / Case: 0603  [CAPC0603(1608)_N]
C39  Package / Case: 0603  Voltage - Rated: 50V  [CAPC0603(1608)_L]  (hidden comment: 0.1uF)
C41  Package / Case: 0603  Voltage - Rated: 50V  [CAPC0603(1608)_L]  (hidden comment: 0.1uF)
C42  1uF  Voltage - Rated: 25V  Package / Case: 0603  [CAPC0603(1608)_N]
C43  Package / Case: 0603  Voltage - Rated: 50V  [CAPC0603(1608)_L]  (hidden comment: 0.1uF)
CN3  FCI-87583-2010  [87583-2010]
CN7  SONAR  [Molex 2x2 Microfit 90deg]
CN8  DHT22  [Molex 1x3 Microfit 90deg]
D5  BZX84C3V6LT1G  Voltage Rating (DC): 3.6V  [SOT23]
D6  BZX84C3V6LT1G  Voltage Rating (DC): 3.6V  [SOT23]
D7  BZX84C3V6LT1G  Voltage Rating (DC): 3.6V  [SOT23]
J1  OLED 0.96"  [OLED_0.96_I2C]
Q4  2N7002P  Continuous Drain Current (ID): 360mA  Drain to Source Voltage (Vdss): 60V  [SOT23]
R25  Resistance: 10K  Package: 0402  [RESC0402(1005)_N]  (hidden comment: 0402WGF1002TCE)
R26  Resistance: 10K  Package: 0402  [RESC0402(1005)_N]  (hidden comment: 0402WGF1002TCE)
R27  Package (Imperial): 0402  Resistance: 12k  [RESC0402(1005)_M]  (hidden comment: RES 12K OHM 1% 1/16W 0402)
R28  Package (Imperial): 0402  [RESC0402(1005)_L]  (hidden comment: 20K)
R29  Resistance: 10K  Package: 0402  [RESC0402(1005)_N]  (hidden comment: 0402WGF1002TCE)
R30  Package / Case: 0603  [RESC0603(1608)_N]  (hidden comment: 4.7K)
R31  Resistance: 10K  Package: 0402  [RESC0402(1005)_N]  (hidden comment: 0402WGF1002TCE)
R32  Resistance: 10K  Package: 0402  [RESC0402(1005)_N]  (hidden comment: 0402WGF1002TCE)
R38  Package (Imperial): 0402  [RESC0402(1005)_M]  (hidden comment: 100)
R39  Package (Imperial): 0402  [RESC0402(1005)_M]  (hidden comment: 100)
SW5  OLED  [SW TACT Red 6mm x 6mm]
U8  DPS310XTSA1  [Infineon_PG-VLGA-8]

### Nets
3.3V: C21.1 C38.1 C41.1 C42.1 CN7.1 CN8.2 J1.2(VCC) Q4.1(G) R25.1 R29.1 R30.2 R31.1 R32.1 U8.6(VDDIO) U8.8(VDD)
5V: C39.1 CN3.1(VBUS) R26.1
GND: C21.2 C38.2 C39.2 C41.2 C42.2 C43.2 CN3.4(GND) CN3.5(SHIELD) CN7.4 CN8.3 D5.1(A) D6.1(A) D7.1(A) J1.1(GND) R28.2 SW5.3 SW5.4 U8.1(GND) U8.7(GND)
BTN_OLED: C43.1 R29.2 SW5.1 SW5.2
DHT22: D7.3(K) R39.2
ECHO: D6.3(K) R27.2 R28.1
MISO: U8.5(SDO)
MOSI: U8.3(SDI)
OLED_SCL: J1.3(SCL) R31.2
OLED_SDA: J1.4(SDA) R32.2
Pres_CS: U8.2(CSB)
SCK: U8.4(SCK)
SOIL_SEN: D5.3(K) R38.2
TRIG: Q4.2(S) R25.2
NetCN3_2: CN3.2(D-) CN3.3(D+) R38.1
NetCN7_2: CN7.2 Q4.3(D) R26.2
NetCN7_3: CN7.3 R27.1
NetCN8_1: CN8.1 R30.1 R39.1

### Notes on the sheet
- Soil Sensor
- Sonar
- (near R25) pg1
- OLED Screen
- (near SW5) C127509
- pg1
- Reassign pins
- (near U8) Pressure Sensor
- KYLE R. DESIGNS - CONFIDENTIAL

### Library data of the parts
C21 C39 C41 C43 = 0.1uF_0603: as C32 on sheet ESP_Grow_Main_V2_1_CPU; Supplier 1: Digi-Key; RoHS: RoHS Compliant; Category: Capacitors; Stock 1: 2360000; Pricing 1: 4000=0.00414, 8000=0.00378, 12000=0.0036, 28000=0.00342, 100000=0.00248 (USD); Packaging: Tape & Reel (TR); Mounting Type: Surface Mount, MLCC; Operating Temperature: -55°C ~ 125°C; Applications: General Purpose; Ratings: -; Size / Dimension: 0.063" L x 0.031" W (1.60mm x 0.80mm); Height - Seated (Max): -; Thickness (Max): 0.034" (0.87mm); Lead Spacing: -; Features: -; Lead Style: -; ComponentLink1URL: http://www.kemet.com/datasheets&C0603C104K4RACTU; ComponentLink1Description: http://www.kemet.com/datasheets&C0603C104K4RACTU; Supplier Part Number 1: 399-1096-2-ND; ComponentLink2Description: New link; ComponentLink2URL: *; LCSC Part #: C14663; Capacitance: 0.1uF
C38 C42 = CAP CER 1UF 25V 10% X7R 0603: as C16 on sheet ESP_Grow_Main_V2_2_Pump_NeoPixel; Supplier 1: Digi-Key; RoHS: RoHS Compliant; Category: Capacitors; Stock 1: 360610; Pricing 1: 1=0.2, 10=0.135, 100=0.0686, 500=0.04696, 1000=0.04154 (USD); Packaging: Cut Tape (CT); Part Status: Active; Operating Temperature: -55°C ~ 125°C; Features: -; Ratings: AEC-Q200; Applications: Automotive; Failure Rate: -; Mounting Type: Surface Mount, MLCC; Size / Dimension: 0.063" L x 0.032" W (1.60mm x 0.80mm); Height - Seated (Max): -; Thickness (Max): 0.035" (0.90mm); Lead Spacing: -; Lead Style: -; ComponentLink1URL: https://product.tdk.com/info/en/catalog/datasheets/mlcc_automotive_general_en.pdf; ComponentLink1Description: https://product.tdk.com/info/en/catalog/datasheets/mlcc_automotive_general_en.pdf; Supplier Part Number 1: 445-6931-1-ND
CN3 = CMP-001-0212-04: USB-A Receptacle; Manufacturer Part Number: 87583-2010BLF; Manufacturer: FCI; Vendor: Digikey; PN: 609-4413-ND; Number of Contacts: 4; Specifications: USB 2.0; ComponentLink1Description: http://portal.fciconnect.com/Comergent//fci/drawing/87583.pdf; Gender: Receptacle; Connector Type: USB - A; Stock 1: 25474; Packaging: Tube; Mounting Type: Surface Mount, Right Angle, Horizontal; Ingress Protection: -; Component Name: FCI-87583-2010; MPN: 87583-2010BLF; ComponentLink1URL: http://portal.fciconnect.com/Comergent//fci/drawing/87583.pdf; Series: 87583; Pin Count: 5; RoHS: RoHS Compliant; Features: Board Lock; Pricing 1: 1=0.89, 10=0.78, 25=0.7344, 50=0.7038, 100=0.6732, 250=0.612, 500=0.5508, 1000=0.4896, 2500=0.4437 (USD); Designator: FCI-87583-2010
CN7 = MICROFIT 3.0 HDR 90deg 4CKT: Molex Microfit 2x2 90deg Header; Manufacturer: Molex Inc; Manufacturer Part Number: 0430450400; Connector Type: Header, Shrouded; Number of Positions: 4; Number of Positions Loaded: All; Pitch: 0.118" (3.00mm); ClassName: *; Supplier 1: Digi-Key; RoHS: RoHS Compliant; Category: Connectors, Interconnects; Stock 1: 9668; Pricing 1: 1=1.35, 10=1.228, 50=1.1026, 100=1.0525, 250=0.95228, 500=0.8771, 1000=0.7518, 2500=0.70168, 5000=0.6666 (USD); Packaging: Tray; Contact Type: Male Pin; Number of Rows: 2; Row Spacing: 0.118" (3.00mm); Contact Mating Length: -; Mounting Type: Through Hole, Right Angle; Termination: Solder; Fastening Type: Locking Ramp; Features: Board Lock; Contact Finish: Tin; Contact Finish Thickness: 100µin (2.54µm); Color: Black; ComponentLink1URL: http://www.molex.com/pdm_docs/sd/430450400_sd.pdf; ComponentLink1Description: http://www.molex.com/pdm_docs/sd/430450400_sd.pdf; Supplier Part Number 1: WM1814-ND
CN8 = MICROFIT 3.0 HDR 90deg 3CKT: Molex Microfit 1x3 90deg Header; Manufacturer: Molex Inc; Manufacturer Part Number: 0436500304; Connector Type: Header, Shrouded; Number of Positions: 3; Number of Positions Loaded: All; Pitch: 0.118" (3.00mm); ClassName: *; Supplier 1: Digi-Key; RoHS: RoHS Compliant; Category: Connectors, Interconnects; Stock 1: 42564; Pricing 1: 1=1.39, 10=1.224, 50=1.104, 100=1.056, 250=0.96, 500=0.864, 1000=0.768, 2500=0.696, 5000=0.672 (USD); Packaging: Tray; Contact Type: Male Pin; Number of Rows: 1; Row Spacing: -; Contact Mating Length: -; Mounting Type: Through Hole, Right Angle; Termination: Solder; Fastening Type: Locking Ramp; Features: Board Lock; Contact Finish: Gold; Contact Finish Thickness: 15µin (0.38µm); Color: Black; ComponentLink1URL: http://www.molex.com/pdm_docs/sd/436500304_sd.pdf; ComponentLink1Description: http://www.molex.com/pdm_docs/sd/436500304_sd.pdf; Supplier Part Number 1: WM1876-ND
D5-D7 = CMP-001-0958-01: DIODE ZENER 3.6V 225MW SOT23-3; ESD Protection: Yes; Tolerance: 6%; Forward Voltage: 900mV; Element Configuration: Single; Peak Reverse Current: 5uA; Zener Current: 10mA; Power Dissipation: 300mW; Test Current: 5mA; Impedance: 90R; Material: Plastic; Max Power Dissipation: 225mW; Halogen Free: Halogen Free; Lead Free: Lead Free; Power Rating: 225mW; REACH SVHC: No SVHC; Radiation Hardening: No; Number of Pins: 3; Working Voltage: 3.6V; Contact Plating: Tin,Matte; Case/Package: SOT-23-3; Length: 0.119inch; Voltage Tolerance: 6%; Max Operating Temperature: 150°C; Packaging: Tape and Reel; Package Quantity: 3000; Width: 0.055inch; Min Operating Temperature: -65°C; Zener Voltage: 3.6V; Height: 0.044inch; Max Reverse Leakage Current: 5uA
J1 = OLED_0.96_I2C: SSD1306 I2C OLED 0.96"
Q4 = CMP-012-0002-05: as Q1 on sheet ESP_Grow_Main_V2_2_Pump_NeoPixel; Contact Plating: Tin; Case/Package: SOT; Number of Pins: 3; Rds On Max: 1.6R; Package Quantity: 10000; Lead Free: Lead Free; Packaging: Tape and Reel; Max Dual Supply Voltage: 60V; Min Operating Temperature: -55°C; Radiation Hardening: No; Drain to Source Breakdown Voltage: 60V; Max Operating Temperature: 150°C
R25 R26 R29 R31 R32 = 10k_0402: 10KOHMS ±1% 1/10W 0402; Supplier Part Number 1: C25744; Manufacturer Part Number 1: 0402WGF1002TCE; Supplier 1: LCSC
R27 = CMP-007-0374-13: 12 kOhms ±1% 0.063W, 1/16W Chip Resistor 0402 (1005 Metric) Automotive AEC-Q200 Thick Film; Power: 63mW; Temperature Coefficient: ±100ppm/°C; Package (Metric): 1005; Termination: SMD/SMT; Tolerance: 1%; Height: 400µm; Operating Temperature: -55°C ~ 155°C; Length: 1mm
R28 = CMP-007-0427-12: RES 20K OHM 1% 1/10W 0402; Power: 63mW; Temperature Coefficient: ±100ppm/°C; Package (Metric): 1005; Tolerance: 1%; Length: 1mm; Resistance: 20k; Operating Temperature: -55°C ~ 155°C; Termination: SMD/SMT; Height: 400µm
R30 = RES 4.7K OHM 1/10W 5% 0603 SMD: 4.7K 0603; Manufacturer: Panasonic Electronic Components; Manufacturer Part Number: ERJ-3GEYJ472V; Tolerance: ±5%; Power (Watts): 0.1W, 1/10W; Temperature Coefficient: ±200ppm/°C; Supplier 1: Digi-Key; RoHS: RoHS Compliant; Category: Resistors; Stock 1: 1261582; Pricing 1: 1=0.1, 50=0.0126, 100=0.0096, 250=0.00716, 500=0.00528, 1000=0.00352, 2500=0.00297 (USD); Packaging: Cut Tape (CT); Resistance (Ohms): 4.7k; Composition: Thick Film; Features: Automotive AEC-Q200 Qualified; Supplier Device Package: 0603; Size / Dimension: 0.063" L x 0.031" W (1.60mm x 0.80mm); Height: 0.022" (0.55mm); Number of Terminations: 2; ComponentLink1URL: http://industrial.panasonic.com/www-cgi/jvcr13pz.cgi?E+PZ+3+AOA0001+ERJ3GEYJ472V+7+WW; ComponentLink1Description: http://industrial.panasonic.com/www-cgi/jvcr13pz.cgi?E+PZ+3+AOA0001+ERJ3GEYJ472V+7+WW; Supplier Part Number 1: P4.7KGCT-ND
R38 R39 = CMP-007-0350-06: RES 100 OHM 1% 1/16W 0402; Power: 63mW; Temperature Coefficient: ±100ppm/°C; Package (Metric): 1005; Operating Temperature: -55°C ~ 155°C; Termination: SMD/SMT; Resistance: 100; Length: 1mm; Height: 400µm; Tolerance: 1%
SW5 = PTS645SM43SMTR92 LFS: as SW3 on sheet ESP_Grow_Main_V2_1_CPU; ClassName: *; Supplier 1: Digi-Key; Manufacturer Part Number: PTS645SM43SMTR92 LFS; RoHS: RoHS Compliant; Category: Switches; Stock 1: 234699; Pricing 1: 1=0.15, 10=0.147, 25=0.1416, 50=0.1366, 100=0.129, 250=0.12144, 500=0.11638 (USD); Packaging: Cut Tape (CT); Part Status: Active; Circuit: SPST-NO; Mounting Type: Surface Mount; Actuator Length, Right Angle: -; Termination Style: Gull Wing; Illumination Type, Color: -; Illumination Voltage (Nominal): -; Ingress Protection: -; Features: Blue Actuator; Switch Travel: -; Operating Temperature: -20°C ~ 60°C; ComponentLink1URL: http://www.ckswitches.com/media/1471/pts645.pdf; ComponentLink1Description: http://www.ckswitches.com/media/1471/pts645.pdf; Supplier Part Number 1: CKN9112CT-ND
U8 = DPS310: SENSOR PRESSURE CAPACITIVE; Pressure Type: Vented Gauge; Operating Pressure: 4.35PSI ~ 17.4PSI (30kPa ~ 120kPa); Output Type: I²C, SPI; Voltage - Supply: 1.7V ~ 3.6V; Accuracy: ±0.5°C; Supplier 1: Digi-Key; Supplier Part Number 1: DPS310XTSA1CT-ND; Package / Case: 8-VFLGA